# Altium schematic sheet Sensors.SchDoc
size A4; DocumentNumber: 6; SheetNumber: 7; SheetTotal: 7
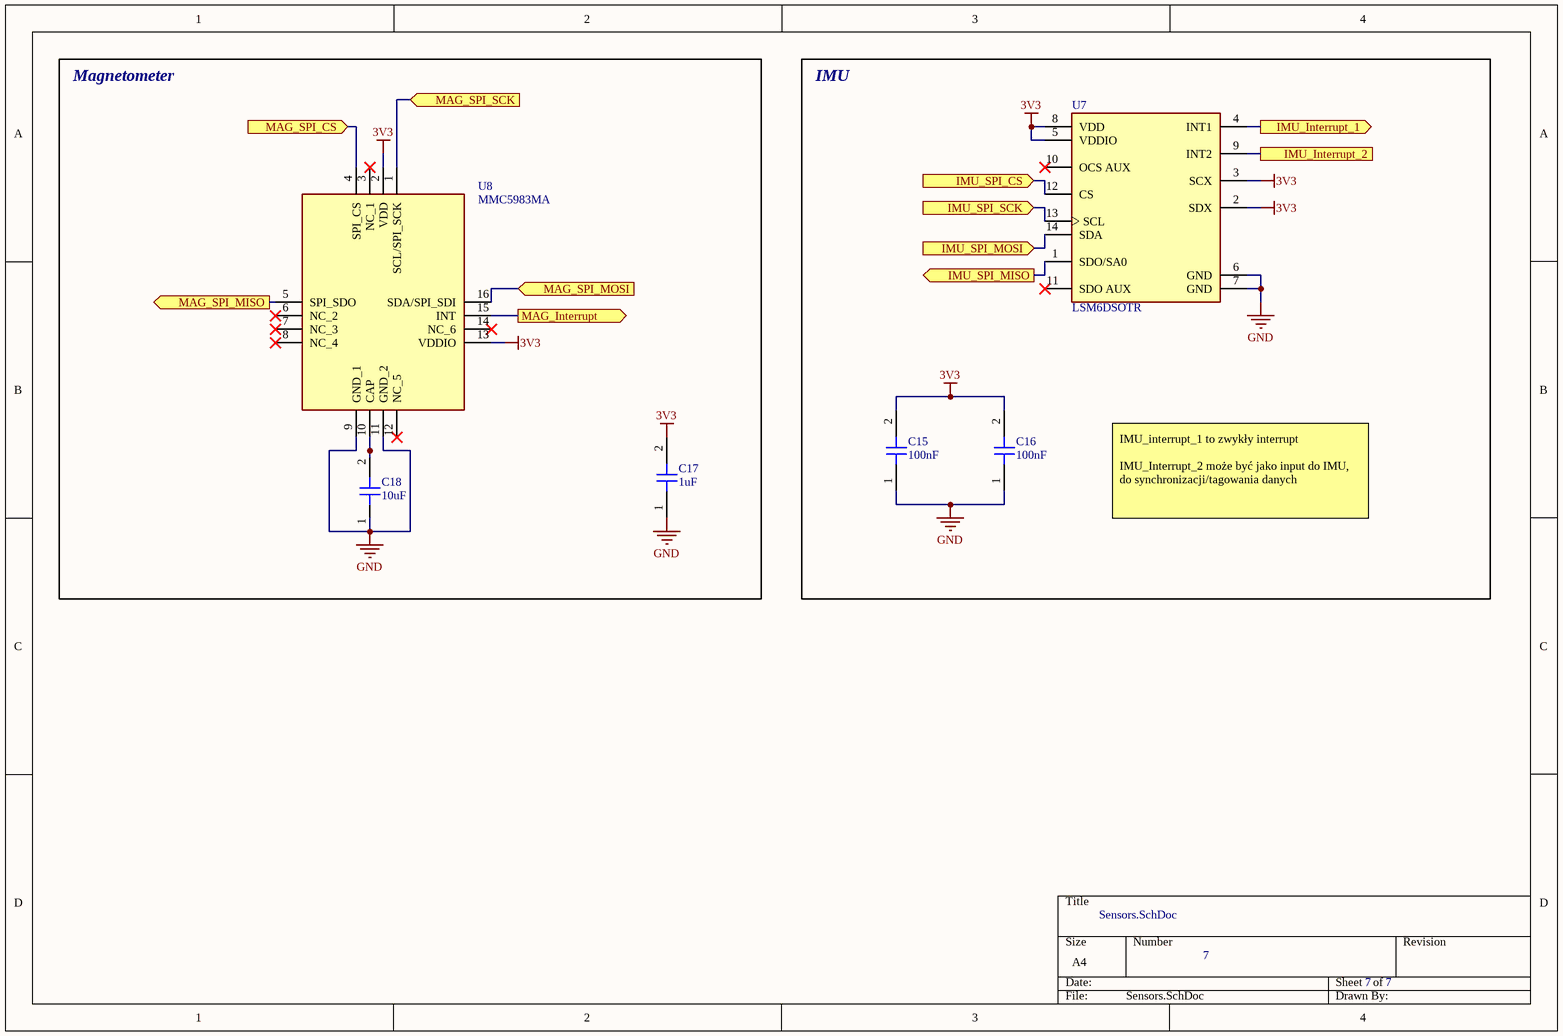
[diagram p0: Sensors.SchDoc]

## Parts
C15  100nF  [Cap_0603_Medium_Density]
C16  100nF  [Cap_0603_Medium_Density]
C17  1uF  [Cap_0603_Medium_Density]
C18  10uF  [Cap_0603_Medium_Density]
U7  LSM6DSOTR  [FP-LGA-14L-DM00249496-MFG]
U8  MMC5983MA  [MMC5983MA]

## Blocks framed on the sheet
Magnetometer: C17 C18 U8
IMU: C15 C16 U7

## Ports
IMU_Interrupt_1 (out), IMU_Interrupt_2, IMU_SPI_CS (in), IMU_SPI_MISO (out), IMU_SPI_MOSI (in), IMU_SPI_SCK (in), MAG_Interrupt (out), MAG_SPI_CS (in), MAG_SPI_MISO (out), MAG_SPI_MOSI (in), MAG_SPI_SCK (in)

## Nets
3V3: C15.2 C16.2 C17.2 U7.2(SDX) U7.3(SCX) U7.5(VDDIO) U7.8(VDD) U8.2(VDD) U8.13(VDDIO)
GND: C15.1 C16.1 C17.1 C18.1 U7.6(GND) U7.7(GND) U8.9(GND_1) U8.11(GND_2)
IMU_Interrupt_1: U7.4(INT1) ; port IMU_Interrupt_1
IMU_Interrupt_2: U7.9(INT2) ; port IMU_Interrupt_2
IMU_SPI_CS: U7.12(CS) ; port IMU_SPI_CS
IMU_SPI_MISO: U7.1(SDO/SA0) ; port IMU_SPI_MISO
IMU_SPI_MOSI: U7.14(SDA) ; port IMU_SPI_MOSI
IMU_SPI_SCK: U7.13(SCL) ; port IMU_SPI_SCK
MAG_Interrupt: U8.15(INT) ; port MAG_Interrupt
MAG_SPI_CS: U8.4(SPI_CS) ; port MAG_SPI_CS
MAG_SPI_MISO: U8.5(SPI_SDO) ; port MAG_SPI_MISO
MAG_SPI_MOSI: U8.16(SDA/SPI_SDI) ; port MAG_SPI_MOSI
MAG_SPI_SCK: U8.1(SCL/SPI_SCK) ; port MAG_SPI_SCK
NetC18_2: C18.2 U8.10(CAP)

Not connected (* = marked no-connect by the designer): U7 10(OCS_AUX)* 11(SDO_AUX)*; U8 3(NC_1)* 6(NC_2)* 7(NC_3)* 8(NC_4)* 12(NC_5)* 14(NC_6)*

## Notes on the sheet
- IMU_interrupt_1 to zwykły interrupt
  IMU_Interrupt_2 może być jako input do IMU, do synchronizacji/tagowania danych

## Library data of the parts
C15 C16 = Capacitor_MLLC: Part Number: CC0603KRX7R8BB104; Supplier: Mouser; ComponentLink1Description: Online Store Link; ComponentLink1URL: *; Manufacturer: *; Value: 100nF; Voltage: *; Package: 0603
C17 = Capacitor_MLLC: Part Number: CC0603KRX5R6BB105; Supplier: Mouser; ComponentLink1Description: Online Store Link; ComponentLink1URL: *; Manufacturer: *; Value: 1uF; Voltage: *; Package: 0603
C18 = Capacitor_MLLC: Part Number: C0603C106M7PAC7411; Supplier: Mouser; ComponentLink1Description: Online Store Link; ComponentLink1URL: *; Manufacturer: *; Value: 10uF; Voltage: *; Package: 0603
U7 = CMP-12177-000012-1: CONSUMER MEMS; Manufacturer: STMicroelectronics; Gyro Range: 125/250/500/1000/2000°/s; Max Supply Voltage: 3.6V; Sensor Output: I2C,SPI; Operating Supply Current: 0.55mA; Min Supply Voltage: 1.62V; Sensor Type: Temperature,Accelerometer,Gyroscope; Height: 0.86mm; Device Class L3: Inertial Measurement Units (IMUs); Device Class L1: Sensors; ComponentLink2Description: Datasheet; Device Class L2: Motion Sensors; Temperature: -40°C to +85°C; Package: LGA-14L-DM00249496; Octopart: https://octopart.com/lsm6dsotr-stmicroelectronics-81706672; Temperature Range Low: -40°C; Digikey Description: CONSUMER MEMS; ComponentLink2URL: https://www.st.com/resource/en/datasheet/lsm6dso.pdf; Manufacturer Part Number: LSM6DSOTR; Mouser Description: iNEMO inertial module: "always-on" integrated 3D accelerometer and 3D gyroscope; Footprint Url: https://www.st.com/content/ccc/resource/technical/document/technical_note/73/17/9c/16/dd/96/4a/01/CD00134799.pdf/files/CD00134799.pdf/jcr:content/translations/en.CD00134799.pdf; Lead Free: Yes; RoHS: TRUE; Category: IC; Temperature Range High: +85°C; Manufacturer_Name: STMicroelectronics; Manufacturer_Part_Number: LSM6DSOTR; Part Number: LSM6DSOTR; Supplier: Mouser
U8 = MMC5983MA: 3-AXIS MAGNETIC SENSOR; Manufacturer_Name: MEMSIC; Geometry.Height: 1mm; Manufacturer_Part_Number: MMC5983MA; Mouser Part Number: 438-MMC5983MA; Mouser Price/Stock: https://www.mouser.co.uk/ProductDetail/MEMSIC/MMC5983MA?qs=B6kkDfuK7%2FD5qasHMdEt2g%3D%3D; Datasheet Link: https://www.mouser.com/datasheet/2/821/Memsic_09102019_MMC5983MA_Datasheet_Rev_A-1635338.pdf; Part Number: MMC5983MA; Supplier: Mouser